# EasyEDA Pro project ChisFlash-MBC5_GBC烧录卡_shn修改plus图纸nds烧录线路+电池加固通孔.epro, schematic ChisFlash-MBC5-v1.1
Board Name: ChisFlash-MBC5-v1.1; Create Date: 2024-11-11; Page Name: P1; Project Name: ChisFlash-MBC5（GBC烧录卡）; Schematic Name: ChisFlash-MBC5-v1.1; Update Date: 2024-11-11; Company: 嘉立创EDA; Page Size: A4; Version: V1.0
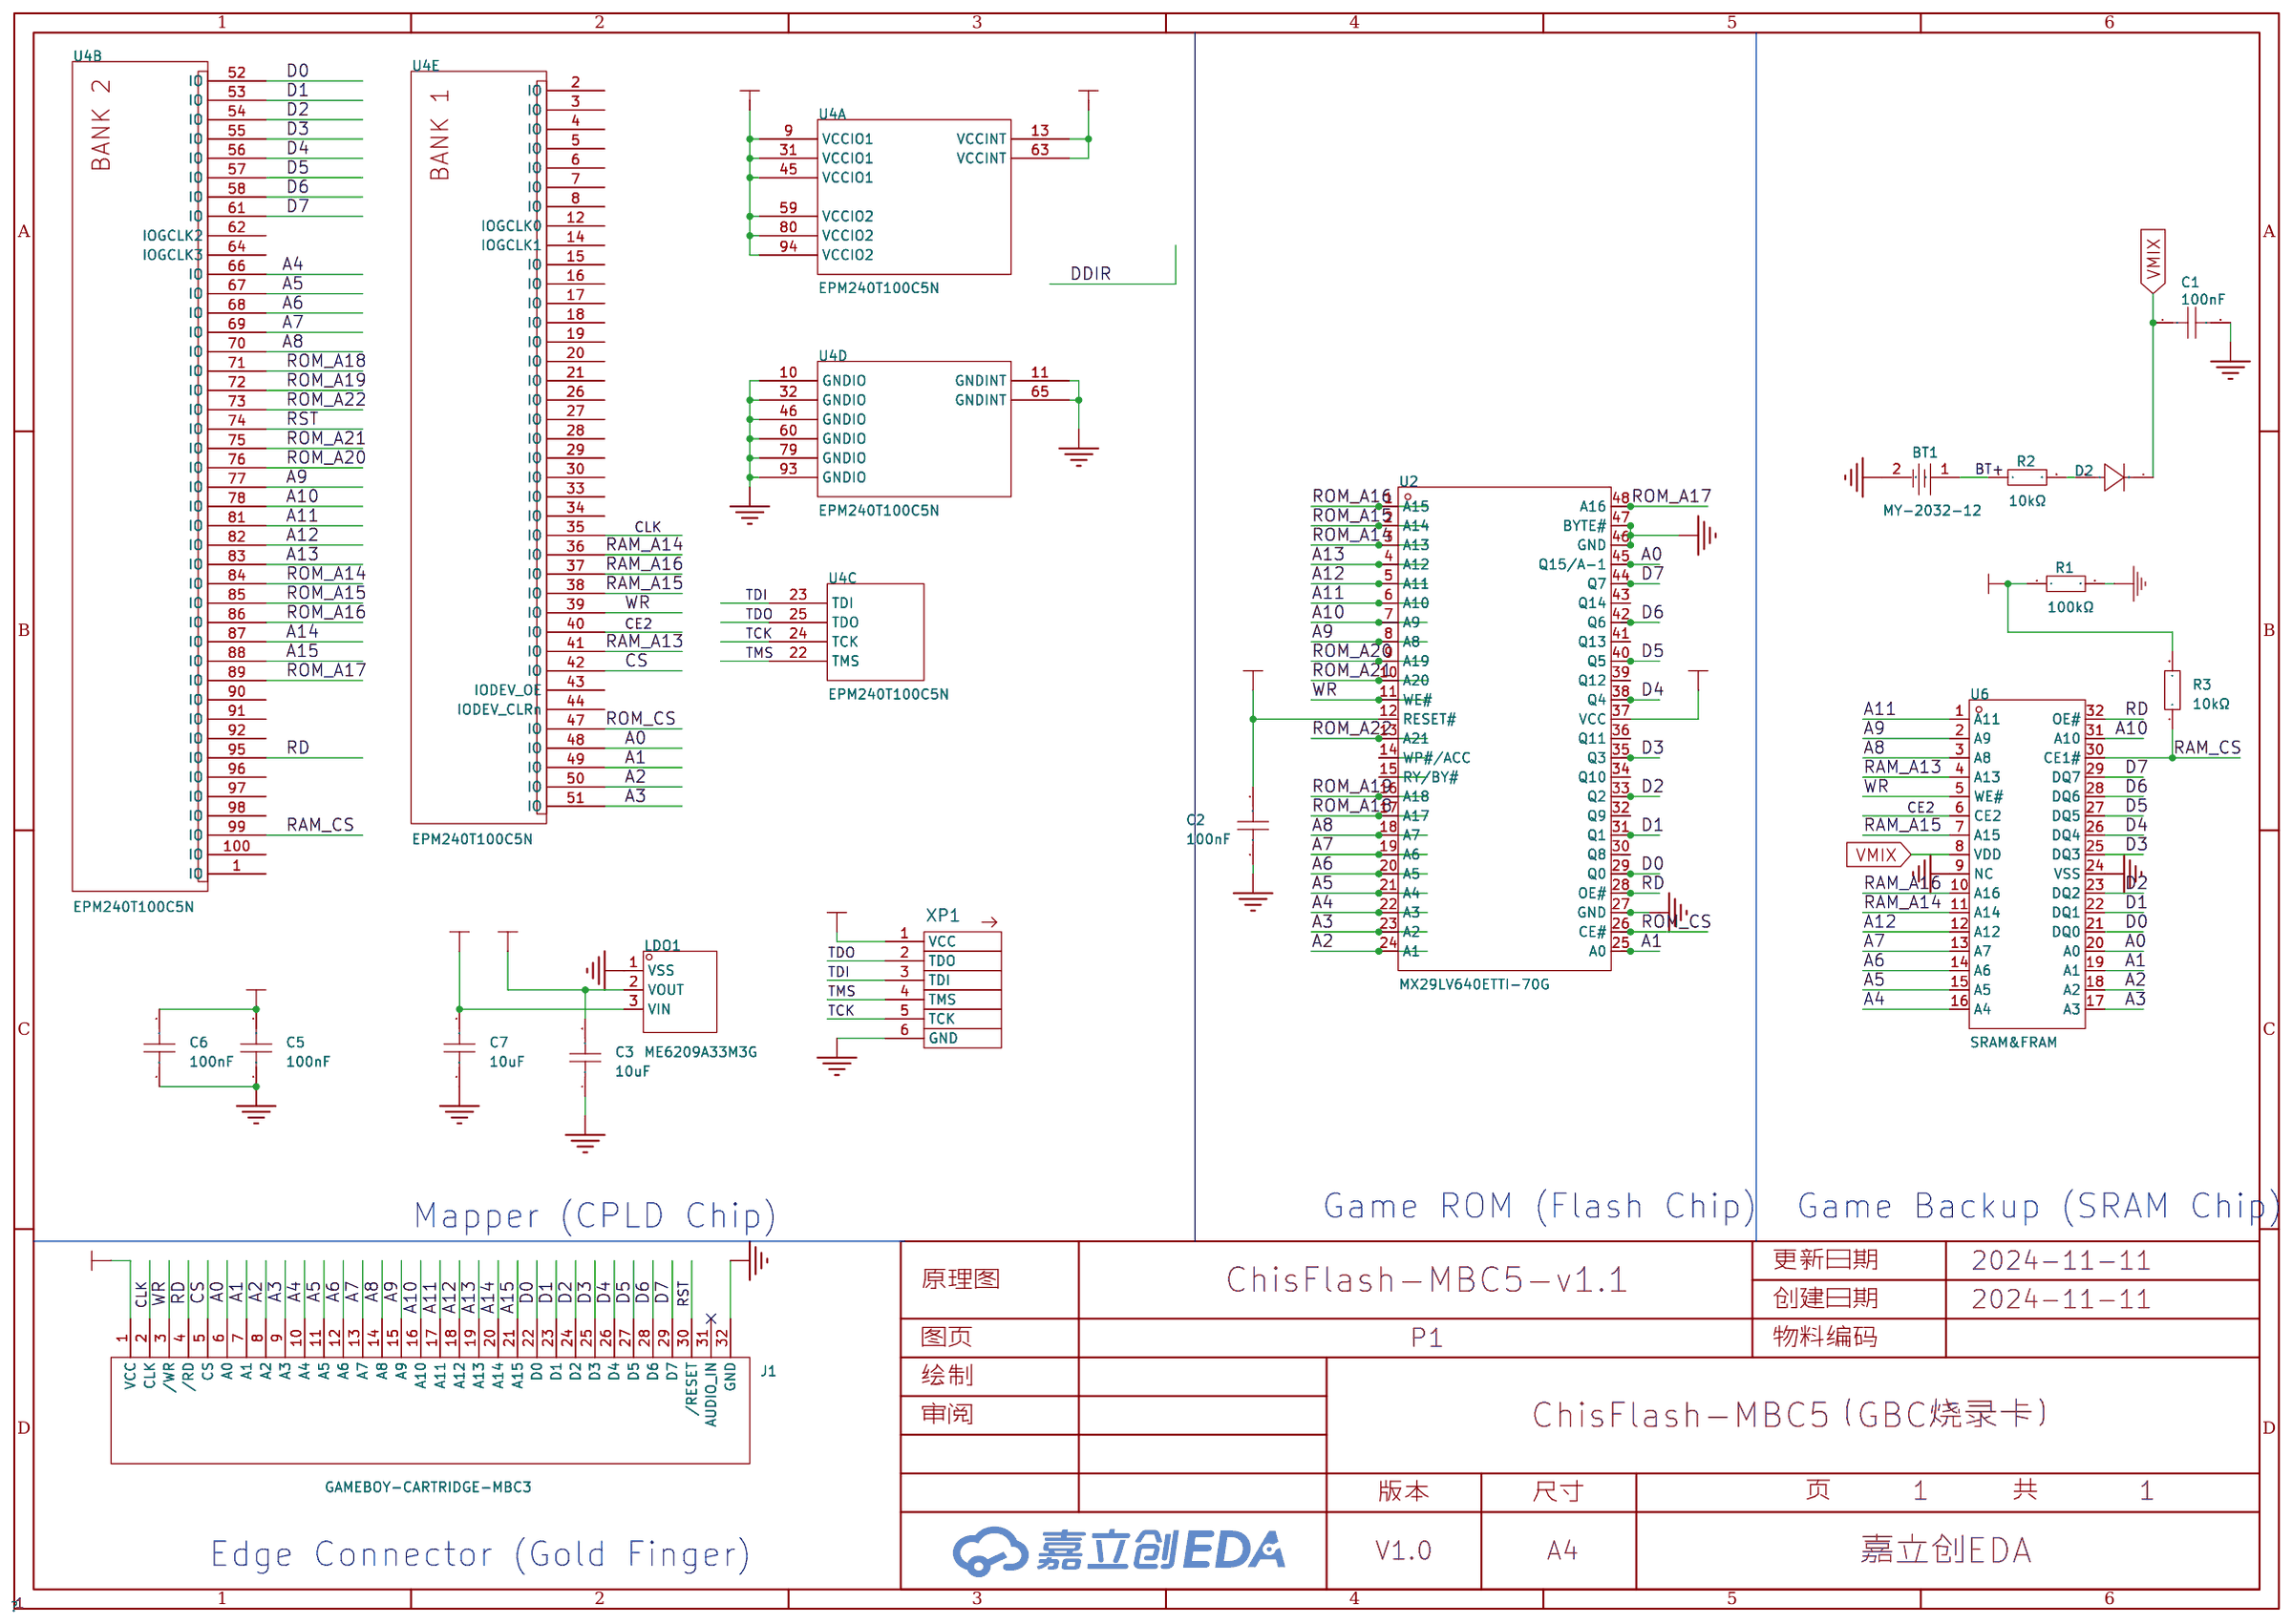
[diagram p1: schematic sheet]

## Parts
BT1  MY-2032-12  [BAT-SMD_MY-2032-12]
C1  100nF  [C0603]
C2  100nF  [C0603]
C3  10uF  [C0603]
C5  100nF  [C0603]
C6  100nF  [C0603]
C7  10uF  [C0603]
D2  1N4148WS  [SOD-323_L1.8-W1.3-LS2.5-RD]
J1  GAMEBOY-CARTRIDGE-MBC3  [GAMEBOY_CARTRIDGE_PIN]
LDO1  ME6209A33M3G  [SOT-23-3_L2.9-W1.6-P1.90-LS2.8-BR]
R1  100kΩ  [R0603]
R2  10kΩ  [R0603]
R3  10kΩ  [R0603]
U2  MX29LV640ETTI-70G  [TSOP-48_L12.0-W18.4-P0.50-LS20.0-BL]
U4  EPM240T100C5N  [TQFP-100_L14.0-W14.0-P0.50-LS16.0-BL]  (sections 1,2,3,4,5)
U6  SRAM&FRAM  [TSSOP-TSOP二合一]
XP1  JTAG  [HDR-TH_6P-P1.27-V-M-1]  (no BOM)

## Library data of the parts
BT1 = MY-2032-12: LCSC Part Name: CR2032 电池扣; Supplier Part: C964833; Manufacturer: MYOUNG(美阳); Supplier Footprint: SMT; JLCPCB Part Class: Extended Part; Datasheet: https://atta.szlcsc.com/upload/public/pdf/source/20201218/C964833_8D2DD5FC6B310B5B4EFEF4B683694189.pdf; Supplier: LCSC
C1 C2 C5 C6 = CGA0603X7R104K500JT: 容值:100nF;精度:±10%;额定电压:50V;材质(温度系数):X7R;; LCSC Part Name: 100nF ±10% 50V; Supplier Part: C6119867; Manufacturer: HRE(芯声); Supplier Footprint: 0603; JLCPCB Part Class: Extended Part; Supplier: LCSC; Tolerance: ±10%; Voltage Rated: 50V; Temperature Coefficient: X7R
C3 C7 = CL10A106MA8NRNC: 容值:10uF;精度:±20%;额定电压:25V;材质(温度系数):X5R;; LCSC Part Name: 10uF ±20% 25V; Supplier Part: C96446; Manufacturer: SAMSUNG(三星); Supplier Footprint: 0603; JLCPCB Part Class: 基础库; Datasheet: https://atta.szlcsc.com/upload/public/pdf/source/20160218/1457707763339.pdf; Supplier: LCSC; Tolerance: ±20%; Voltage Rated: 25V; Temperature Coefficient: X5R
D2 = 1N4148WS_C917117: 二极管配置:独立式;正向压降(Vf):1.25V@150mA;直流反向耐压(Vr):100V;平均整流电流(Io):300mA;功率:400mW;反向恢复时间(trr):8ns;; LCSC Part Name: 电压:100V 电流:300mA; Supplier Part: C917117; Manufacturer: JSMSEMI(杰盛微); Supplier Footprint: SOD-323; JLCPCB Part Class: Extended Part; Datasheet: https://atta.szlcsc.com/upload/public/pdf/source/20230807/08D9F448A82EA88A23B325A669586A09.pdf; Supplier: LCSC; Diode Configuration: 独立式; Forward Voltage (Vf@If): 1.25V@150mA; Reverse Voltage (Vr): 100V; Average Rectified Current (Io): 300mA; Power Dissipation: 400mW; Reverse Leakage Current: 1uA@75V; Reverse Recovery Time (trr): 8ns; Operating Temperature: -55℃~+150℃@(Tj)
J1 = GAMEBOY-CARTRIDGE-MBC3
LDO1 = ME6209A33M3G: 输出类型:固定;最大输入电压:18V;输出电压:3.3V;最大输出电流:250mA;电源纹波抑制比(PSRR):-;输出极性:正极;; LCSC Part Name: 输入18V 输出3.3V 250mA; Supplier Part: C83508; Manufacturer: MICRONE(南京微盟); Supplier Footprint: SOT-23-3L; JLCPCB Part Class: 扩展库; Datasheet: https://atta.szlcsc.com/upload/public/pdf/source/20161212/1481539101152.pdf; Supplier: LCSC; Output Type: 固定; Maximum Input Voltage: 18V; Output Voltage: 3.3V; MAX Output Current: 250mA; Dropout Voltage: 80mV@(40mA); Output Polarity: 正极; Number of Outputs: 1
R1 = 0603WAF1003T5E: 电阻类型:厚膜电阻;阻值:100kΩ;精度:±1%;功率:100mW;最大工作电压:75V;温度系数:±100ppm/℃;; LCSC Part Name: 100kΩ ±1% 100mW 厚膜电阻; Supplier Part: C25803; Manufacturer: UNI-ROYAL(厚声); Supplier Footprint: 0603; JLCPCB Part Class: Basic Part; Datasheet: https://atta.szlcsc.com/upload/public/pdf/source/20200306/C422600_1E6D84923E4A46A82E41ADD87F860B5C.pdf; Supplier: LCSC; Type: 厚膜电阻; Tolerance: ±1%; Power(Watts): 100mW; Overload Voltage (Max): 75V; Temperature Coefficient: ±100ppm/℃; Operating Temperature Range: -55℃~+155℃; Resistance: 47K
R2 R3 = 0603WAF1002T5E: 电阻类型:厚膜电阻;阻值:10kΩ;精度:±1%;功率:100mW;温度系数:±100ppm/℃;最大工作电压:75V;工作温度范围:-55℃~+155℃;; LCSC Part Name: 10kΩ ±1% 100mW; Supplier Part: C25804; Manufacturer: UNI-ROYAL(厚声); Supplier Footprint: 0603; JLCPCB Part Class: Basic Part; Datasheet: https://atta.szlcsc.com/upload/public/pdf/source/20200306/C422600_1E6D84923E4A46A82E41ADD87F860B5C.pdf; Supplier: LCSC; Type: 厚膜电阻; Tolerance: ±1%; Power(Watts): 100mW; Temperature Coefficient: ±100ppm/℃; Overload Voltage (Max): 75V; Operating Temperature Range: -55℃~+155℃; Resistance: 47K
U2 = MX29LV640ETTI-70G: Supplier Part: C504703; Manufacturer: MXIC(旺宏电子); Supplier Footprint: TSOP-48-18.4mm; JLCPCB Part Class: 扩展库; Datasheet: https://atta.szlcsc.com/upload/public/pdf/source/20140417/1457707044232.pdf; Supplier: LCSC
U4 = EPM240T100C5N: 类型:其它PLD;逻辑门数量:-;逻辑单元数:-;逻辑阵列块数:240;; Supplier Part: C10041; Manufacturer: Intel/Altera; Supplier Footprint: TQFP-100(14x14); JLCPCB Part Class: 扩展库; Datasheet: https://atta.szlcsc.com/upload/public/pdf/source/20121123/1457706563537.pdf; Supplier: LCSC; Type: 其它PLD; Supply Voltage Range - VCCIO: 3.3V；2.5V; Logic Array Blocks: 240; Maximum Delay Time Tpd: 4.7ns; Operating Temperature Range: 0℃~+85℃
U6 = SRAM&FRAM
XP1 = jtag

## Nets
+3V3: C2.2 C3.2 C5.2 C6.2 LDO1.2(VOUT) R1.1 R3.2 U2.12(RESET#) U2.37(VCC) U4.9(VCCIO1) U4.13(VCCINT) U4.31(VCCIO1) U4.45(VCCIO1) U4.59(VCCIO2) U4.63(VCCINT) U4.80(VCCIO2) U4.94(VCCIO2) XP1.1(VCC)
+5V: C7.2 J1.1(VCC) LDO1.3(VIN)
GND: BT1.2 C1.2 C2.1 C3.1 C5.1 C6.1 C7.1 J1.32(GND) LDO1.1(VSS) R1.2 U2.27(GND) U2.46(GND) U2.47(BYTE#) U4.10(GNDIO) U4.11(GNDINT) U4.32(GNDIO) U4.46(GNDIO) U4.60(GNDIO) U4.65(GNDINT) U4.79(GNDIO) U4.93(GNDIO) U6.9(NC) U6.24(VSS) XP1.6(GND)
A0: J1.6(A0) U2.45(Q15/A-1) U4.48(IO) U6.20(A0)
A1: J1.7(A1) U2.25(A0) U4.49(IO) U6.19(A1)
A2: J1.8(A2) U2.24(A1) U4.50(IO) U6.18(A2)
A3: J1.9(A3) U2.23(A2) U4.51(IO) U6.17(A3)
A4: J1.10(A4) U2.22(A3) U4.66(IO) U6.16(A4)
A5: J1.11(A5) U2.21(A4) U4.67(IO) U6.15(A5)
A6: J1.12(A6) U2.20(A5) U4.68(IO) U6.14(A6)
A7: J1.13(A7) U2.19(A6) U4.69(IO) U6.13(A7)
A8: J1.14(A8) U2.18(A7) U4.70(IO) U6.3(A8)
A9: J1.15(A9) U2.8(A8) U4.77(IO) U6.2(A9)
A10: J1.16(A10) U2.7(A9) U4.78(IO) U6.31(A10)
A11: J1.17(A11) U2.6(A10) U4.81(IO) U6.1(A11)
A12: J1.18(A12) U2.5(A11) U4.82(IO) U6.12(A12)
A13: J1.19(A13) U2.4(A12) U4.83(IO)
A14: J1.20(A14) U4.87(IO)
A15: J1.21(A15) U4.88(IO)
BT+: BT1.1 R2.1
CE2: U4.40(IO) U6.6(CE2)
CLK: J1.2(CLK) U4.35(IO)
CS: J1.5(CS) U4.42(IO)
D0: J1.22(D0) U2.29(Q0) U4.52(IO) U6.21(DQ0)
D1: J1.23(D1) U2.31(Q1) U4.53(IO) U6.22(DQ1)
D2: J1.24(D2) U2.33(Q2) U4.54(IO) U6.23(DQ2)
D3: J1.25(D3) U2.35(Q3) U4.55(IO) U6.25(DQ3)
D4: J1.26(D4) U2.38(Q4) U4.56(IO) U6.26(DQ4)
D5: J1.27(D5) U2.40(Q5) U4.57(IO) U6.27(DQ5)
D6: J1.28(D6) U2.42(Q6) U4.58(IO) U6.28(DQ6)
D7: J1.29(D7) U2.44(Q7) U4.61(IO) U6.29(DQ7)
RAM_A13: U4.41(IO) U6.4(A13)
RAM_A14: U4.36(IO) U6.11(A14)
RAM_A15: U4.38(IO) U6.7(A15)
RAM_A16: U4.37(IO) U6.10(A16)
RAM_CS: R3.1 U4.99(IO) U6.30(CE1#)
RD: J1.4(/RD) U2.28(OE#) U4.95(IO) U6.32(OE#)
ROM_A14: U2.3(A13) U4.84(IO)
ROM_A15: U2.2(A14) U4.85(IO)
ROM_A16: U2.1(A15) U4.86(IO)
ROM_A17: U2.48(A16) U4.89(IO)
ROM_A18: U2.17(A17) U4.71(IO)
ROM_A19: U2.16(A18) U4.72(IO)
ROM_A20: U2.9(A19) U4.76(IO)
ROM_A21: U2.10(A20) U4.75(IO)
ROM_A22: U2.13(A21) U4.73(IO)
ROM_CS: U2.26(CE#) U4.47(IO)
RST: J1.30(/RESET) U4.74(IO)
TCK: U4.24(TCK) XP1.5(TCK)
TDI: U4.23(TDI) XP1.3(TDI)
TDO: U4.25(TDO) XP1.2(TDO)
TMS: U4.22(TMS) XP1.4(TMS)
VMIX: C1.1 D2.1(C) U6.8(VDD)
WR: J1.3(/WR) U2.11(WE#) U4.39(IO) U6.5(WE#)
$1N4617: D2.2(A) R2.2

Not connected (* = marked no-connect by the designer): J1 31(AUDIO_IN)*; U2 14(WP#/ACC) 15(RY/BY#) 30(Q8) 32(Q9) 34(Q10) 36(Q11) 39(Q12) 41(Q13) 43(Q14); U4 1(IO) 2(IO) 3(IO) 4(IO) 5(IO) 6(IO) 7(IO) 8(IO) 12(IOGCLK0) 14(IOGCLK1) 15(IO) 16(IO) 17(IO) 18(IO) 19(IO) 20(IO) 21(IO) 26(IO) 27(IO) 28(IO) 29(IO) 30(IO) 33(IO) 34(IO) 43(IODEV_OE) 44(IODEV_CLRn) 62(IOGCLK2) 64(IOGCLK3) 90(IO) 91(IO) 92(IO) 96(IO) 97(IO) 98(IO) 100(IO)

## Notes on the sheet
- Mapper (CPLD Chip)
- Game ROM (Flash Chip)
- Game Backup (SRAM Chip)
- Edge Connector (Gold Finger)
